# Altium project AuArd.PrjPcb
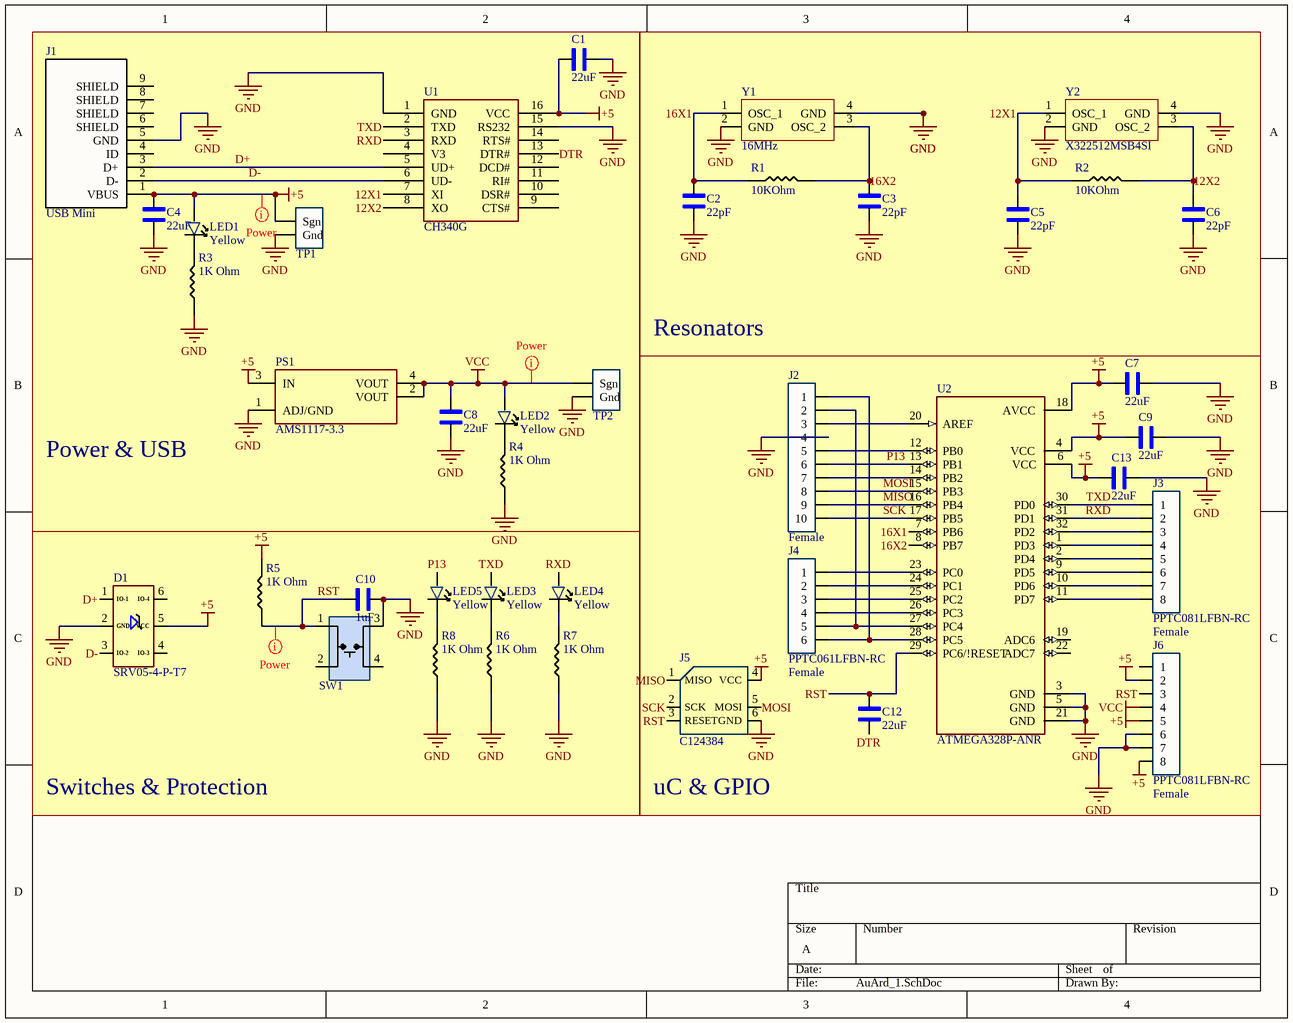
[diagram p0: AuArd_1.SchDoc]
1 sheet, 40 parts. Net scope: global (net labels, ports and power ports of the same name join across sheets).
Board file: ECEN4730_AUA1_2021-10-18.PcbDoc

## Sheet AuArd_1.SchDoc
size A; SheetNumber: 1; SheetTotal: 1

### Parts
C1  22uF  [1206_Passive_Capacitor]
C2  22pF  [1206_Passive_Capacitor]
C3  22pF  [1206_Passive_Capacitor]
C4  22uF  [1206_Passive_Capacitor]
C5  22pF  [1206_Passive_Capacitor]
C6  22pF  [1206_Passive_Capacitor]
C7  22uF  [1206_Passive_Capacitor]
C8  22uF  [1206_Passive_Capacitor]
C9  22uF  [1206_Passive_Capacitor]
C10  1uF  [1206_Passive_Capacitor]
C12  22uF  [1206_Passive_Capacitor]
C13  22uF  [1206_Passive_Capacitor]
D1  SRV05-4-P-T7  [TVS]
J1  USB Mini  [USB_MINI_B]
J2  value Female  [10_PIN_ARDUINO_100MIL]  (hidden comment: PPTC101LFBN-RC)
J3  PPTC081LFBN-RC  value Female  [8_PIN_ARDUINO_100MIL]
J4  PPTC061LFBN-RC  value Female  [6_PIN_ARDUINO_100mil]
J5  LCSC Part#: C124384  [ICSP]  (hidden comment: NRPN032PAEN-RC)
J6  PPTC081LFBN-RC  value Female  [8_PIN_ARDUINO_100MIL]
LED1  value Yellow  [LED_0603]  (hidden comment: KT-0603R)
LED2  value Yellow  [LED_0603]  (hidden comment: KT-0603R)
LED3  value Yellow  [LED_0603]  (hidden comment: KT-0603R)
LED4  value Yellow  [LED_0603]  (hidden comment: KT-0603R)
LED5  value Yellow  [LED_0603]  (hidden comment: KT-0603R)
PS1  AMS1117-3.3  [LDO]
R1  value 10KOhm  [1206_Passive_Resitor]  (hidden comment: 10k)
R2  value 10KOhm  [1206_Passive_Resitor]  (hidden comment: 10k)
R3  value 1K Ohm  [1206_Passive_Resitor]  (hidden comment: 1k)
R4  value 1K Ohm  [1206_Passive_Resitor]  (hidden comment: 1k)
R5  value 1K Ohm  [1206_Passive_Resitor]  (hidden comment: 1k)
R6  value 1K Ohm  [1206_Passive_Resitor]  (hidden comment: 1k)
R7  value 1K Ohm  [1206_Passive_Resitor]  (hidden comment: 1k)
R8  value 1K Ohm  [1206_Passive_Resitor]  (hidden comment: 1k)
SW1  TL3305AF160QG  [Switch_JLC]  (value not drawn)
TP1  10x Probe TP  [TP10x_Probe]  (value not drawn)
TP2  10x Probe TP  [TP10x_Probe]  (value not drawn)
U1  CH340G  [USB to serial]
U2  ATMEGA328P-ANR  [ATMega328P]
Y1  value 16MHz  [Crystal resonator]  (hidden comment: X322516MLB4SI)
Y2  X322512MSB4SI  [Crystal resonator]

### Blocks framed on the sheet
Power & USB: C1 C4 C8 J1 LED1 LED2 PS1 R3 R4 TP1 TP2 U1
Resonators: C2 C3 C5 C6 R1 R2 Y1 Y2
uC & GPIO: C7 C9 C12 C13 J2-J6 U2
Switches & Protection: C10 D1 LED3-LED5 R5-R8 SW1

### Nets
+5: C1.2 C4.2 C7.2 C9.2 C13.2 D1.5(VCC) J1.1(VBUS) J5.4(VCC) J6.2 J6.5 J6.8 LED1.1 PS1.3(IN) R5.2 TP1.1(Sgn) U1.16(VCC) U2.4(VCC) U2.6(VCC) U2.18(AVCC)
GND: C1.1 C2.1 C3.1 C4.1 C5.1 C6.1 C7.1 C8.1 C9.1 C10.2 C13.1 D1.2(GND) J1.5(GND) J2.4 J5.6(GND) J6.6 J6.7 PS1.1(ADJ/GND) R3.1 R4.1 R6.1 R7.1 R8.1 SW1.3 TP1.2(Gnd) TP2.2(Gnd) U1.1(GND) U1.15(RS232) U2.3(GND) U2.5(GND) U2.21(GND) Y1.2(GND) Y1.4(GND) Y2.2(GND) Y2.4(GND)
VCC: C8.2 J6.4 LED2.1 PS1.2(VOUT) PS1.4(VOUT) TP2.1(Sgn)
12X1: C5.2 R2.1 U1.7(XI) Y2.1(OSC_1)
12X2: C6.2 R2.2 U1.8(XO) Y2.3(OSC_2)
16X1: C2.2 R1.1 U2.7(PB6) Y1.1(OSC_1)
16X2: C3.2 R1.2 U2.8(PB7) Y1.3(OSC_2)
D+: D1.1(IO-1) J1.3(D+) U1.5(UD+)
D-: D1.3(IO-2) J1.2(D-) U1.6(UD-)
DTR: C12.1 U1.13(DTR#)
MISO: J2.9 J5.1(MISO) U2.16(PB4)
MOSI: J2.8 J5.5(MOSI) U2.15(PB3)
P13: J2.6 LED5.1 U2.13(PB1)
RST: C10.1 C12.2 J5.3(RESET) J6.3 R5.1 SW1.1 U2.29(PC6/!RESET)
RXD: J3.2 LED4.1 U1.3(RXD) U2.31(PD1)
SCK: J2.10 J5.2(SCK) U2.17(PB5)
TXD: J3.1 LED3.1 U1.2(TXD) U2.30(PD0)
NetJ2_1: J2.1 J4.6 U2.28(PC5)
NetJ2_2: J2.2 J4.5 U2.27(PC4)
NetJ2_3: J2.3 U2.20(AREF)
NetJ2_5: J2.5 U2.12(PB0)
NetJ2_7: J2.7 U2.14(PB2)
NetJ3_3: J3.3 U2.32(PD2)
NetJ3_4: J3.4 U2.1(PD3)
NetJ3_5: J3.5 U2.2(PD4)
NetJ3_6: J3.6 U2.9(PD5)
NetJ3_7: J3.7 U2.10(PD6)
NetJ3_8: J3.8 U2.11(PD7)
NetJ4_1: J4.1 U2.23(PC0)
NetJ4_2: J4.2 U2.24(PC1)
NetJ4_3: J4.3 U2.25(PC2)
NetJ4_4: J4.4 U2.26(PC3)
NetLED1_2: LED1.2 R3.2
NetLED2_2: LED2.2 R4.2
NetLED3_2: LED3.2 R6.2
NetLED4_2: LED4.2 R7.2
NetLED5_2: LED5.2 R8.2

Not connected (* = marked no-connect by the designer): D1 4(IO-3) 6(IO-4); J1 4(ID) 6(SHIELD) 7(SHIELD) 8(SHIELD) 9(SHIELD); J6 1; SW1 2 4; U1 4(V3) 9(CTS#) 10(DSR#) 11(RI#) 12(DCD#) 14(RTS#); U2 19(ADC6) 22(ADC7)

### Layout directives
rule Width Constraint [Pref Width = 20mil    Min Width = 10mil    Max Width = 100mil]: +5, RST, VCC

### Library data of the parts
C1 C4 C7-C9 C12 C13 = C_22uF_1206: 22uF ±10% 25V X5R 1206 Multilayer Ceramic Capacitors MLCC - SMD/SMT RoHS; MFR Part #: CL31A226KAHNNNE; Type: Extended; LCSC Part#: C12891; Datasheet: https://datasheet.lcsc.com/lcsc/1811031514_Samsung-Electro-Mechanics-CL31A226KAHNNNE_C12891.pdf; Value: 22uF
C2 C3 C5 C6 = C_22pF_1206: 22pF ±5% 1kV C0G 1206 Multilayer Ceramic Capacitors MLCC - SMD/SMT RoHS; MFR Part #: 1206CG220J102NT; Type: Extended; LCSC Part#: C313096; Datasheet: https://datasheet.lcsc.com/lcsc/1810311150_FH-Guangdong-Fenghua-Advanced-Tech-1206CG220J102NT_C313096.pdf; Value: 22pF
C10 = C_1uF_1206: MULTILAYER CERAMIC CAPACITORS MLCC - SMD/SMT 1UF 50V 1206 ROHS; MFR Part #: CL31B105KBHNNNE; Type: Basic; Digikey Link: https://www.digikey.com/product-detail/en/C1206C105M4RACTU/399-8150-1-ND/3471873/?itemSeq=304982366; Digikey Part: 399-8150-1-ND; LCSC Part#: C1848; Value: 1uF
D1 = D_TVS_Diode: TVS SOT-23-6 ROHS; Value: TVS DIODE 5.5V 6TSOP; Type: Basic; MFR Part #: SRV05-4-P-T7; LCSC Part#: C85364; Datasheet: https://datasheet.lcsc.com/szlcsc/ProTek-Devices-SRV05-4-P-T7_C85364.pdf
J1 = J_USB_B_Mini: Through Hole USB Connectors RoHS; MFR Part #: 920-462A2021D10102; Value: USB mini B; LCSC Part#: C46398; Datasheet: https://datasheet.lcsc.com/szlcsc/2103081233_Jing-Extension-of-the-Electronic-Co-920-462A2021D10102_C46398.pdf; Type: Extended
J2 = JF_10_PIN_FEMALE_ARDUINO: 10 Position Header Connector 0.100" (2.54mm) Through Hole Tin; Digikey Link: https://www.digikey.com/product-detail/en/PPTC101LFBN-RC/S7008-ND/810149/?itemSeq=304982352; Digikey Part: S7008-ND; LCSC Part#: C225507; Type: Extended
J3 J6 = JF_8_PIN_FEMALE_ARDUINO: 8 Position Header Connector 0.100" (2.54mm) Through Hole Tin; Digikey Link: https://www.digikey.com/product-detail/en/PPTC081LFBN-RC/S7006-ND/810147/?itemSeq=304982354; Digikey Part: S7006-ND; Type: Extended; LCSC Part#: C27438
J4 = JF_6_PIN_FEMALE_ARDUINO: 6 Position Header Connector 0.100" (2.54mm) Through Hole Tin; Digikey Link: https://www.digikey.com/product-detail/en/PPTC061LFBN-RC/S7004-ND/810145/?itemSeq=304982353; Digikey Part: S7004-ND; LCSC Part#: C40877; Type: Extended
J5 = J_ICSP: Connector Header Through Hole 6 position 0.079" (2.00mm); Digikey Link: https://www.digikey.com/product-detail/en/NRPN032PAEN-RC/S5801-03-ND/804955/?itemSeq=304982355; Digikey Part: S5801-03-ND; Value: NRPN032PAEN-RC; Type: Extended
LED1-LED5 = LED_YELLOW_0603: LIGHT EMITTING DIODES (LED) YELLOW 585.5~591.5NM 90~180MCD@20MA TOP VIEW 0603 ROHS; MFR Part #: 19-213/Y2C-CQ2R2L/3T(CY); Type: Basic; Datasheet: https://datasheet.lcsc.com/szlcsc/Everlight-Elec-19-217-BHC-ZL1M2RY-3T_C72041.pdf; LCSC Part#: C72038
PS1 = PS_AMS_LDO_3v3: LOW DROPOUT REGULATORS(LDO) POSITIVE FIXED 1.3V @ 800MA 15V 3.3V 1A SOT-223 ROHS; Value: IC REG LINEAR 3.3V 800MA SOT223; MFR Part #: AMS1117-3.3; LCSC Part#: C6186; Type: Basic
R1 R2 = R_10KOhm_1206: 10 kOhms ±5% 0.25W, 1/4W Chip Resistor 1206 (3216 Metric) Automotive AEC-Q200 Thick Film; Digikey Link: https://www.digikey.com/product-detail/en/RMCF1206JT300R/RMCF1206JT300RCT-ND/1942776/?itemSeq=304982374; Digikey Part: RMCF1206JT300RCT-ND; LCSC Part#: C17902; Type: Basic
R3-R8 = R_1K_1206: CHIP RESISTOR - SURFACE MOUNT 1KOHMS ±1% 1/4W 1206 ROHS; MFR Part #: 1206W4F1001T5; Digikey Link: https://www.digikey.com/product-detail/en/RNCP1206FTD1K00/RNCP1206FTD1K00CT-ND/2240675/?itemSeq=304982373; Digikey Part: RNCP1206FTD1K00CT-ND; LCSC Part#: C4410; Type: Basic
SW1 = SW_Push_Button_JLC: Tactile Switch SPST-NO Top Actuated Surface Mount; MFR Part #: C174049; LCSC Part#: C174049; Type: Extended
TP1 TP2 = TP_10x_Probe: Test Point 300 mil centers
U1 = U_USBtoSerial: Transceiver USB 2.0 2Mbps SOP-16_150mil USB ICs RoHS; Datasheet: https://datasheet.lcsc.com/lcsc/2008191806_WCH-Jiangsu-Qin-Heng-CH340G_C14267.pdf; LCSC Part#: C14267; MFR Part #: CH340G; Type: Basic; Value: USB to Serial
U2 = U_ATMega328P: AVR AVR® ATmega Microcontroller IC 8-Bit 20MHz 32KB (16K x 16) FLASH 32-TQFP (7x7); MFR Part #: ATMEGA328P-AU; Value: IC MCU 8BIT 32KB FLASH 32TQFP; Digikey Link: https://www.digikey.com/product-detail/en/ATMEGA328P-ANR/ATMEGA328P-ANRCT-ND/2774230/?itemSeq=304982365; LCSC Part#: C14877; Type: Basic
Y1 = X_16Mhz_Res: ±10ppm 16000000Hz -40℃~85℃ 贴片无源晶振 60Ω 9pF SMD3225-4P Crystals ROHS; LCSC Part#: C13738; MFR Part #: X322516MLB4SI; Type: Basic
Y2 = X_12MHz_Res: SMD Crystal Resonators 12MHz ±10ppm SMD-3225_4P RoHS; LCSC Part#: C9002; MFR Part #: X322512MSB4SI; Value: 12MHz; Type: Basic; Datasheet: https://datasheet.lcsc.com/szlcsc/Yangxing-Tech-X322512MSB4SI_C9002.pdf